# Altium schematic sheet ECE1895_Upsilon_PCB_Iteration3_FINAL.SchDoc
size A; SheetNumber: 1; SheetTotal: 1
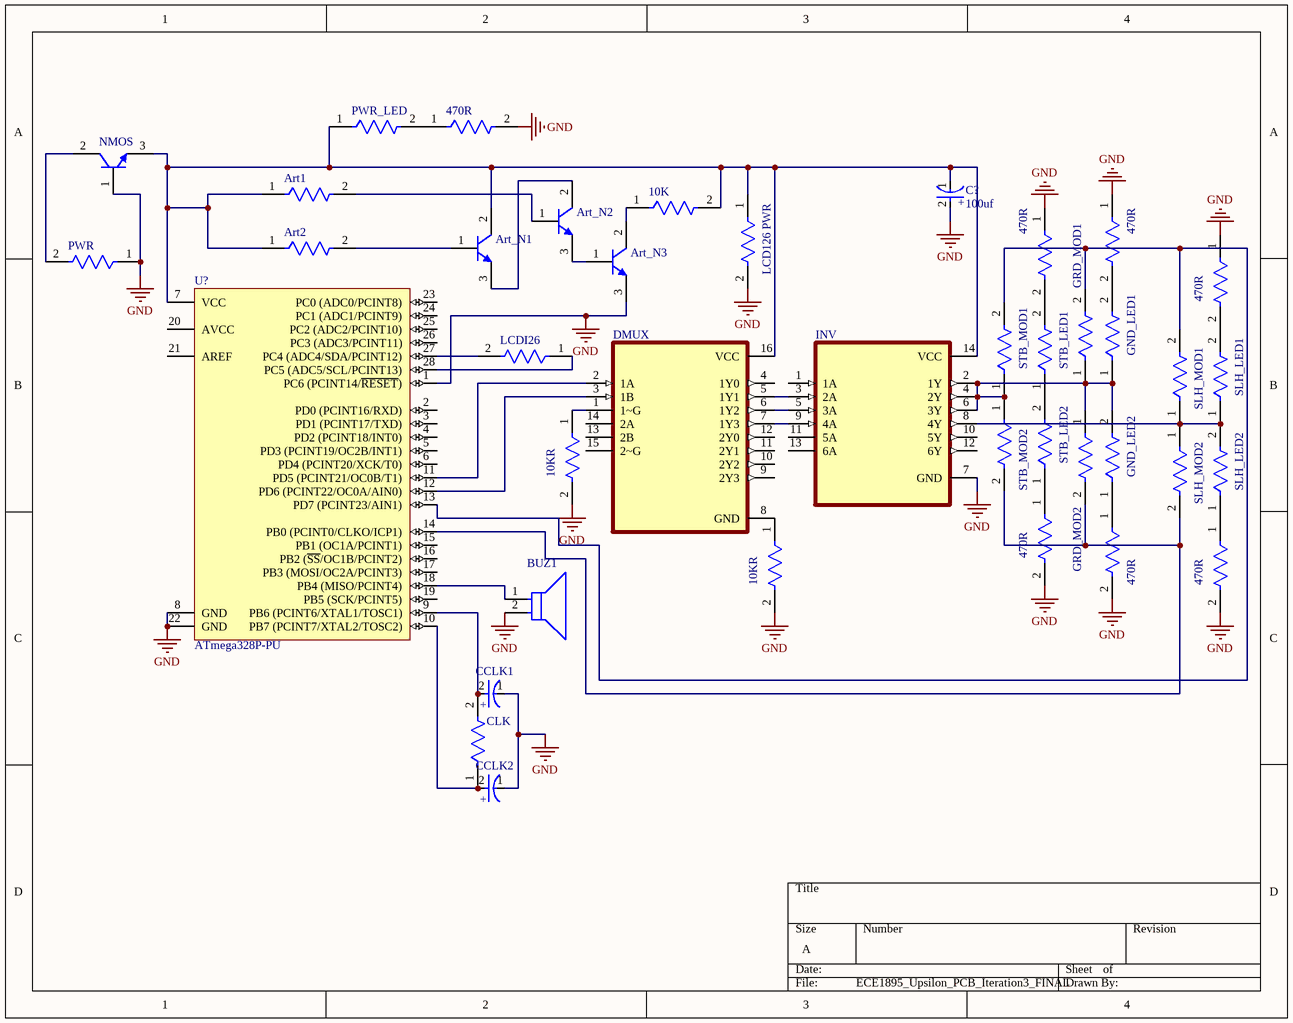
[diagram p0: ECE1895_Upsilon_PCB_Iteration3_FINAL.SchDoc]

## Parts
(Parts that share a designator on the sheet are numbered #1, #2 ... from top to bottom, then left to right.)
10K  (no value)  [FP-MRS25-MFG]
10KR#1  (no value)  [FP-MRS25-MFG]
10KR#2  (no value)  [FP-MRS25-MFG]
470R#1  (no value)  [FP-MRS25-MFG]
470R#2  (no value)  [FP-MRS25-MFG]
470R#3  (no value)  [FP-MRS25-MFG]
470R#4  (no value)  [FP-MRS25-MFG]
470R#5  (no value)  [FP-MRS25-MFG]
470R#6  (no value)  [FP-MRS25-MFG]
470R#7  (no value)  [FP-MRS25-MFG]
Art1  (no value)  [FP-MRS25-MFG]
Art2  (no value)  [FP-MRS25-MFG]
Art_N1  2N2222A  [STM-TO-18-3]  (value not drawn)
Art_N2  2N2222A  [STM-TO-18-3]  (value not drawn)
Art_N3  2N2222A  [STM-TO-18-3]  (value not drawn)
BUZ1  (no value)  [FP-PS1720P02-MFG]
C?  100uf  [FP-RAD-TH-D_16_0_5-L_25_2-MFG]
CCLK1  (no value)  [FP-RAD-TH-D_16_0_5-L_25_2-MFG]
CCLK2  (no value)  [FP-RAD-TH-D_16_0_5-L_25_2-MFG]
CLK  (no value)  [FP-MRS25-MFG]
DMUX  (no value)  [DIP794W45P254L1969H508Q16]
GND_LED1  (no value)  [FP-MRS25-MFG]
GND_LED2  (no value)  [FP-MRS25-MFG]
GRD_MOD1  (no value)  [FP-MRS25-MFG]
GRD_MOD2  (no value)  [FP-MRS25-MFG]
INV  (no value)  [DIP794W45P254L1969H508Q14]
LCD126_PWR  (no value)  [FP-MRS25-MFG]
LCDI26  (no value)  [FP-MRS25-MFG]
NMOS  NMOS  [ONSC-TO-220-3-221A-09]  (value not drawn)
PWR  (no value)  [FP-MRS25-MFG]
PWR_LED  (no value)  [FP-MRS25-MFG]
SLH_LED1  (no value)  [FP-MRS25-MFG]
SLH_LED2  (no value)  [FP-MRS25-MFG]
SLH_MOD1  (no value)  [FP-MRS25-MFG]
SLH_MOD2  (no value)  [FP-MRS25-MFG]
STB_LED1  (no value)  [FP-MRS25-MFG]
STB_LED2  (no value)  [FP-MRS25-MFG]
STB_MOD1  (no value)  [FP-MRS25-MFG]
STB_MOD2  (no value)  [FP-MRS25-MFG]
U?  ATmega328P-PU  [28P3]

## Nets
GND: 10KR#1.2 10KR#2.2 470R#1.2 470R#2.1 470R#3.1 470R#4.1 470R#5.2 470R#6.2 470R#7.2 Art_N3.3(E) BUZ1.2 C?.2(A) CCLK1.1(C) CCLK2.1(C) INV.7(GND) LCD126_PWR.2 NMOS.1(B) PWR.1 U?.1(PC6_(PCINT14/~{RESET})) U?.8(GND) U?.22(GND)
Net10K_1: 10K.1 Art_N3.2(C)
Net10K_2: 10K.2 Art1.1 Art2.1 Art_N1.2(C) C?.1(C) DMUX.16(VCC) INV.14(VCC) LCD126_PWR.1 NMOS.3(E) PWR_LED.1 U?.7(VCC)
Net10KR#1_1: 10KR#1.1 DMUX.1(1~G)
Net10KR#2_1: 10KR#2.1 DMUX.8(GND)
Net470R#1_1: 470R#1.1 PWR_LED.2
Net470R#2_2: 470R#2.2 GND_LED1.2
Net470R#3_2: 470R#3.2 STB_LED1.2
Net470R#4_2: 470R#4.2 SLH_LED1.2
Net470R#5_1: 470R#5.1 STB_LED2.1
Net470R#6_1: 470R#6.1 GND_LED2.1
Net470R#7_1: 470R#7.1 SLH_LED2.1
NetArt1_2: Art1.2 Art_N2.1(B)
NetArt2_2: Art2.2 Art_N1.1(B)
NetArt_N1_3: Art_N1.3(E) Art_N2.2(C)
NetArt_N2_3: Art_N2.3(E) Art_N3.1(B)
NetBUZ1_1: BUZ1.1 U?.18(PB4_(MISO/PCINT4))
NetCCLK1_2: CCLK1.2(A) CLK.2 U?.9(PB6_(PCINT6/XTAL1/TOSC1))
NetCCLK2_2: CCLK2.2(A) CLK.1 U?.10(PB7_(PCINT7/XTAL2/TOSC2))
NetDMUX_2: DMUX.2(1A) U?.11(PD5_(PCINT21/OC0B/T1))
NetDMUX_3: DMUX.3(1B) U?.12(PD6_(PCINT22/OC0A/AIN0))
NetDMUX_5: DMUX.5(1Y1) INV.3(2A)
NetDMUX_6: DMUX.6(1Y2) INV.5(3A)
NetDMUX_7: DMUX.7(1Y3) INV.9(4A)
NetGND_LED1_1: GND_LED1.1 GND_LED2.2 GRD_MOD1.1 GRD_MOD2.1 INV.2(1Y) INV.4(2Y) INV.6(3Y) STB_MOD1.1 STB_MOD2.1
NetGRD_MOD1_2: GRD_MOD1.2 SLH_MOD1.2 STB_MOD1.2 U?.13(PD7_(PCINT23/AIN1))
NetGRD_MOD2_2: GRD_MOD2.2 SLH_MOD2.2 STB_MOD2.2 U?.14(PB0_(PCINT0/CLKO/ICP1))
NetINV_8: INV.8(4Y) SLH_LED1.1 SLH_LED2.2 SLH_MOD1.1 SLH_MOD2.1
NetLCDI26_1: LCDI26.1 U?.28(PC5_(ADC5/SCL/PCINT13))
NetLCDI26_2: LCDI26.2 U?.27(PC4_(ADC4/SDA/PCINT12))
NetNMOS_2: NMOS.2(C) PWR.2
NetSTB_LED1_1: STB_LED1.1 STB_LED2.2

Not connected (* = marked no-connect by the designer): DMUX 4(1Y0) 9(2Y3) 10(2Y2) 11(2Y1) 12(2Y0) 13(2B) 14(2A) 15(2~G); INV 1(1A) 10(5Y) 11(5A) 12(6Y) 13(6A); U? 2(PD0_(PCINT16/RXD)) 3(PD1_(PCINT17/TXD)) 4(PD2_(PCINT18/INT0)) 5(PD3_(PCINT19/OC2B/INT1)) 6(PD4_(PCINT20/XCK/T0)) 15(PB1_(OC1A/PCINT1)) 16(PB2_(~{SS}/OC1B/PCINT2)) 17(PB3_(MOSI/OC2A/PCINT3)) 19(PB5_(SCK/PCINT5)) 20(AVCC) 21(AREF) 23(PC0_(ADC0/PCINT8)) 24(PC1_(ADC1/PCINT9)) 25(PC2_(ADC2/PCINT10)) 26(PC3_(ADC3/PCINT11))

## Notes on the sheet
- (in symbol CMP-05427-001116-1) +

## Library data of the parts
10K 10KR#1 10KR#2 470R#1-470R#7 Art1 Art2 CLK GND_LED1 GND_LED2 GRD_MOD1 GRD_MOD2 LCD126_PWR LCDI26 PWR PWR_LED SLH_LED1 SLH_LED2 SLH_MOD1 SLH_MOD2 STB_LED1 STB_LED2 STB_MOD1 STB_MOD2 = CMP-02408-000051-1: RES 1K OHM 0.6W 1% AXIAL; Power Rating: 600mW; Lead Diameter: 0.6mm; Voltage Rating (DC): 350V; Resistance: 1kR; Temperature Coefficient: 50ppm/°C; Width: 2.5mm; Military Standard: Not; Package Quantity: 5000; Radiation Hardening: No; Case/Package: Axial; Resistance Tolerance: 1%; Resistor Type: Metal Film; Contact Plating: Tin; Length: 6.5mm; Lead Free: Lead Free; RoHS Compliant: Yes; Mount: Through Hole; Number of Pins: 2; Technology: THIN FILM; Voltage Rating: 350V; Min Operating Temperature: -55°C; Weight: 0.00776oz; Diameter: 2.5mm; Construction: Cylindrical; Series: MRS25; Tolerance: 1%; Packaging: Tape and Reel; Max Operating Temperature: 155°C; Max Power Dissipation: 600mW; Number of Terminations: 2; Termination: Axial
Art_N1-Art_N3 = CMP-2000-05381-1: High Speed Switch, 0.6 A IC, -65 to 175 degC, 3-Pin TO-18, RoHS, Bulk; Manufacturer: STMicroelectronics; Power Dissipation Pd: 500mW; DC Current Gain hFE: 300hFE; Transistor Polarity: NPN; DC Collector Current: 600mA; No. of Pins: 3Pins; Transition Frequency ft: 300MHz; Collector Emitter Voltage V(br)ceo: 40V; Product Range: -; Package Reference: TO-18-3; Datasheet URL: https://datasheet.ciiva.com/25917/cd00003223-25917094.pdf; Automotive Qualification Standard: -; Transistor Case Style: TO-18; Operating Temperature Max: 175degC; Datasheet Version: Feb-03; Package Description: 3-Pin Through Hole Device, Dia 5.8 mm, Pitch 1.27 mm; Manufacturer URL: http://www.st.com/
BUZ1 = CMP-08413-000001-1: AUDIO PIEZO TRANSDUCER 30V TH; Manufacturer Part Number: PS1720P02; Manufacturer: TDK Corporation; Frequency: 2kHz; Standoff Height: 0.5mm; RoHS: TRUE; ComponentLink2URL: https://product.tdk.com/info/en/catalog/datasheets/piezoelectronic_buzzer_ps_en.pdf; ComponentLink2Description: Datasheet; Lead Free: Yes; Temperature Range High: +70°C; Category: Speak; Height: 8.3mm; Device Class L1: Electromechanical; Device Class L3: Buzzers; Package: 0; Mouser Description: Audio Indicators & Alerts Round 17mmx8mm 2 kHz Vin=3V; Digikey Description: AUDIO PIEZO TRANSDUCER 30V TH; Device Class L2: Audio Products; Temperature Range Low: -10°C; Automotive: No; Octopart: https://octopart.com/ps1720p02-tdk-154429; Temperature: -10°C to +70°C
C? CCLK1 CCLK2 = CMP-05427-001116-1: Aluminum Electrolytic Capacitors (Radial Lead Type) 47uF ±20% 400V; Ripple Current (AC): 1.18A; Dissipation Factor: 0.24%; Dielectric Material: Aluminium; Life (Hours): 10000Hour; Lead Diameter: 0.8mm; Leakage Current: 1.138mA; Mount: Through Hole; Diameter: 16mm; Number of Pins: 2; Capacitance: 47uF; Package Quantity: 100; Voltage: 400V; Voltage Rating (DC): 400V; Max Operating Temperature: 105°C; Termination: Radial; Case/Package: Radial; Lead Free: Lead Free; Construction: RADIAL; Lead Pitch: 7.5mm; Series: EE; Tolerance: 20%; Length: 25mm; RoHS Compliant: Yes; Ripple Current: 1.18A; Height - Seated (Max): 0.984inch; Radiation Hardening: No; Height: 25mm; Voltage Rating: 400V; Packaging: Bulk; Min Operating Temperature: -25°C; REACH SVHC: No SVHC
DMUX = SN74HC139N: Dual 2-Line To 4-Line Decoders/Demultiplexers 16-PDIP -40 to 85; MF: Texas Instruments; Mouser-Purchase-URL: https://snapeda.com/shop?store=Mouser&id=572560; MP: SN74HC139N; Value: *; DigiKey-Purchase-URL: https://snapeda.com/shop?store=DigiKey&id=572560; Package: PDIP-16 Texas Instruments; Texas_Instruments-Purchase-URL: https://snapeda.com/shop?store=Texas+Instruments&id=572560; Price: None; Availability: Unavailable; SnapEDA_Link: https://www.snapeda.com/parts/SN74HC139N/Texas%20Instruments/view-part/572560/?ref=snap
INV = SN7404N: 6-ch, 4.75-V to 5.25-V bipolar inverters; MF: Texas Instruments; Price: None; Availability: In Stock; Package: PDIP-14 Texas Instruments; MP: SN7404N; Value: *; SnapEDA_Link: https://www.snapeda.com/parts/SN7404N/Texas+Instruments/view-part/?ref=snap; Purchase-URL: https://pricing.snapeda.com/search/part/SN7404N/?ref=eda; Check_prices: https://www.snapeda.com/parts/SN7404N/Texas+Instruments/view-part/?ref=eda
NMOS = CMP-1048-01098-1: High Voltage NPN Silicon Power Transistor, 3-Pin TO-220, Pb-Free, Tube; Manufacturer: On Semiconductor; PartNumber: TIP50G; IC Continuous (A): 1; fT Min (MHz): 10; DatasheetVersion: Rev. 10; PackageReference: TO-220-3-221A-09; ComponentLink1Description: Manufacturer URL; PackageDescription: 3-Pin Flange Mount, Vertical Straight Lead, Body 9.97 x 4.445 mm, Pitch 2.54 mm; ComponentLink3Description: Package Specification; Packing: Tube; ComponentLink3URL: http://www.onsemi.com/pub_link/Collateral/221A-09.PDF; ComponentLink1URL: http://www.onsemi.com/; ComponentLink2URL: http://www.onsemi.com/pub_link/Collateral/TIP47-D.PDF; RoHS: TRUE; PackageVersion: Rev. AG, 09/2011; ComponentLink2Description: Datasheet; Polarity: NPN; Mounting Technology: Through Hole
U? = CMP-0095-00013-2: 8-bit AVR Microcontroller, 32KB Flash, 1KB EEPROM, 2KB SRAM, 28-pin PDIP, Industrial Grade (-40°C to 85°C); RevisionNote: DatasheetVersion updated. URLs added.; PackageVersion: revB, Sep-2001; PackageDescription: 28-lead (0.300"/7.62mm Wide) Plastic Dual Inline Package (PDIP); DatasheetVersion: revD, May-2011; ComponentLink1Description: Manufacturer URL; ComponentLink1URL: http://www.atmel.com/; PackageReference: 28P3; ComponentLink2Description: ATmega48A/48PA/88A/88PA/168A/168PA/328/328P Datasheet; ComponentLink3URL: http://www.atmel.com/dyn/resources/prod_documents/8271S.pdf; ComponentLink2URL: http://www.atmel.com/dyn/resources/prod_documents/8271.pdf; ComponentLink3Description: ATmega48A/48PA/88A/88PA/168A/168PA/328/328P Summary